# EAGLE design selwx_r1 (EAGLE 5.10)
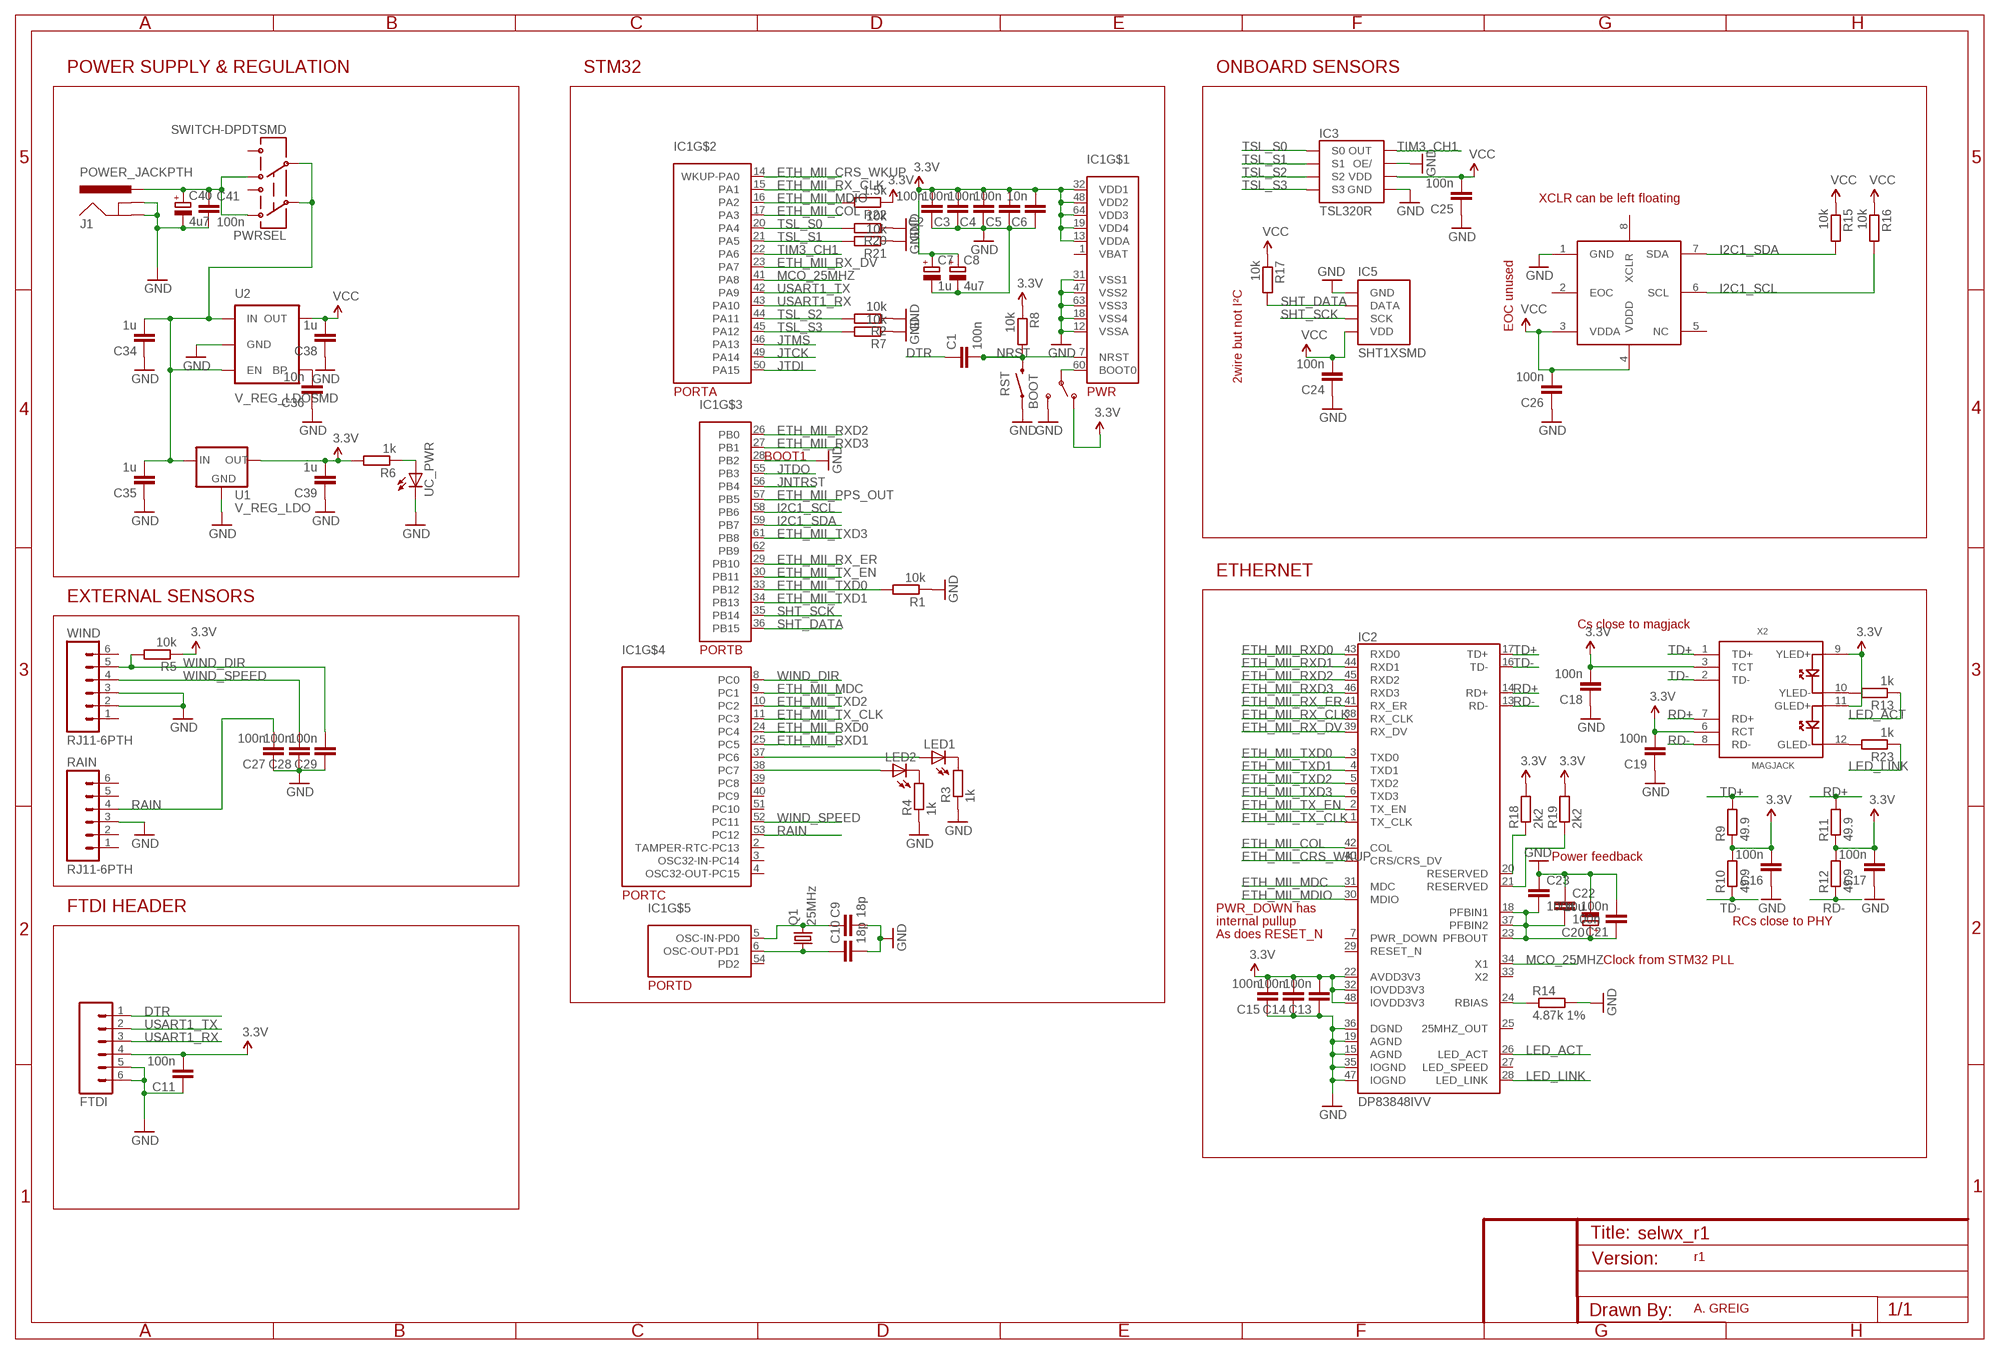
[diagram p0: schematic, sheet 1]

## Parts
BOOT  SWITCH-SPSTSMD  [AYZ0202]
C1  100n  C-EUC0603  [C0603]
C2  100n  C-EUC0603  [C0603]
C3  100n  C-EUC0603  [C0603]
C4  100n  C-EUC0603  [C0603]
C5  100n  C-EUC0603  [C0603]
C6  10n  C-EUC0603  [C0603]
C7  1u  CPOL-EUSMCA  [SMC_A]
C8  4u7  CPOL-EUSMCA  [SMC_A]
C9  18p  C-EUC0603  [C0603]
C10  18p  C-EUC0603  [C0603]
C11  100n  C-EUC0603  [C0603]
C13  100n  C-EUC0603  [C0603]
C14  100n  C-EUC0603  [C0603]
C15  100n  C-EUC0603  [C0603]
C16  100n  C-EUC0603  [C0603]
C17  100n  C-EUC0603  [C0603]
C18  100n  C-EUC0603  [C0603]
C19  100n  C-EUC0603  [C0603]
C20  10u  CPOL-EUSMCA  [SMC_A]
C21  100n  C-EUC0603  [C0603]
C22  100n  C-EUC0603  [C0603]
C23  100n  C-EUC0603  [C0603]
C24  100n  C-EUC0603  [C0603]
C25  100n  C-EUC0603  [C0603]
C26  100n  C-EUC0603  [C0603]
C27  100n  C-EUC0603  [C0603]
C28  100n  C-EUC0603  [C0603]
C29  100n  C-EUC0603  [C0603]
C34  1u  C-EUC0603  [C0603]
C35  1u  C-EUC0603  [C0603]
C36  10n  C-EUC0603  [C0603]
C38  1u  C-EUC0603  [C0603]
C39  1u  C-EUC0603  [C0603]
C40  4u7  CPOL-EUSMCA  [SMC_A]
C41  100n  C-EUC0603  [C0603]
FTDI  M06SIP_LOCK  [1X06-SIP_LOCK]
IC1  STM32F107RXTX  [LQFP64]
IC2  DP83848IVV  [LQFP48]
IC3  TSL320R  [DIL08]
IC5  SHT1XSMD  [SHT1X]
IC6  BMP085  [BMP085]
J1  POWER_JACKPTH  [POWER_JACK_PTH]
LED1  LED0603  [LED-0603]
LED2  LED0603  [LED-0603]
PWRSEL  SWITCH-DPDTSMD  [AYZ0202]
Q1  25MHz  CRYSTAL5X3  [CRYSTAL-SMD-5X3]
R1  10k  R-EU_R0603  [R0603]
R2  10k  R-EU_R0603  [R0603]
R3  1k  R-EU_R0603  [R0603]
R4  1k  R-EU_R0603  [R0603]
R5  10k  R-EU_R0603  [R0603]
R6  1k  R-EU_R0603  [R0603]
R7  10k  R-EU_R0603  [R0603]
R8  10k  R-EU_R0603  [R0603]
R9  49.9  R-EU_R0603  [R0603]
R10  49.9  R-EU_R0603  [R0603]
R11  49.9  R-EU_R0603  [R0603]
R12  49.9  R-EU_R0603  [R0603]
R13  1k  R-EU_R0603  [R0603]
R14  4.87k 1%  R-EU_R0603  [R0603]
R15  10k  R-EU_R0603  [R0603]
R16  10k  R-EU_R0603  [R0603]
R17  10k  R-EU_R0603  [R0603]
R18  2k2  R-EU_R0603  [R0603]
R19  2k2  R-EU_R0603  [R0603]
R20  10k  R-EU_R0603  [R0603]
R21  10k  R-EU_R0603  [R0603]
R22  1.5k  R-EU_R0603  [R0603]
R23  1k  R-EU_R0603  [R0603]
RAIN  RJ11-6PTH  [RJ11-6]
RST  SWITCH-MOMENTARY-2SMD  [TACTILE_SWITCH_SMD]
U1  V_REG_LDO  V_REG_MIC2920  [SOT223]
U2  V_REG_LDOSMD  [SOT23-5]
UC_PWR  LED3MM  [LED3MM]
WIND  RJ11-6PTH  [RJ11-6]
X2  MAGJACK  [MAGJACK]

## Nets
3.3V: BOOT.1(O) C2.2 C3.2 C4.2 C5.2 C6.2 C7.+ C8.+ C11.2 C13.2 C14.2 C15.2 C16.2 C17.2 C18.2 C19.2 C39.2 FTDI.4 IC1.13(VDDA) IC1.19(VDD4) IC1.32(VDD1) IC1.48(VDD2) IC1.64(VDD3) IC2.22(AVDD3V3) IC2.32(IOVDD3V3) IC2.48(IOVDD3V3) R5.1 R6.2 R8.1 R9.1 R10.2 R11.1 R12.2 R18.2 R19.2 R22.1 U1.3(OUT) X2.3(TCT) X2.6(RCT) X2.9(YLED+) X2.11(GLED+)
BOOT0: BOOT.2(P) IC1.60(BOOT0)
DTR: C1.1 FTDI.1
ETH_MII_COL: IC1.17(PA3) IC2.42(COL)
ETH_MII_CRS_WKUP: IC1.14(WKUP-PA0) IC2.40(CRS/CRS_DV)
ETH_MII_MDC: IC1.9(PC1) IC2.31(MDC)
ETH_MII_MDIO: IC1.16(PA2) IC2.30(MDIO) R22.2
ETH_MII_PPS_OUT: IC1.57(PB5)
ETH_MII_RX_CLK: IC1.15(PA1) IC2.38(RX_CLK)
ETH_MII_RX_DV: IC1.23(PA7) IC2.39(RX_DV)
ETH_MII_RX_ER: IC1.29(PB10) IC2.41(RX_ER)
ETH_MII_RXD0: IC1.24(PC4) IC2.43(RXD0)
ETH_MII_RXD1: IC1.25(PC5) IC2.44(RXD1)
ETH_MII_RXD2: IC1.26(PB0) IC2.45(RXD2)
ETH_MII_RXD3: IC1.27(PB1) IC2.46(RXD3)
ETH_MII_TX_CLK: IC1.11(PC3) IC2.1(TX_CLK)
ETH_MII_TX_EN: IC1.30(PB11) IC2.2(TX_EN)
ETH_MII_TXD0: IC1.33(PB12) IC2.3(TXD0) R1.2
ETH_MII_TXD1: IC1.34(PB13) IC2.4(TXD1)
ETH_MII_TXD2: IC1.10(PC2) IC2.5(TXD2)
ETH_MII_TXD3: IC1.61(PB8) IC2.6(TXD3)
GND: BOOT.3(S) C2.1 C3.1 C4.1 C5.1 C6.1 C7.- C8.- C9.2 C10.2 C11.1 C13.1 C14.1 C15.1 C16.1 C17.1 C18.1 C19.1 C20.- C21.2 C22.1 C23.1 C24.1 C25.1 C26.1 C27.1 C28.1 C29.1 C34.1 C35.1 C36.1 C38.1 C39.1 C40.- C41.2 FTDI.5 FTDI.6 IC1.12(VSSA) IC1.18(VSS4) IC1.28(PB2) IC1.31(VSS1) IC1.47(VSS2) IC1.63(VSS3) IC2.15(AGND) IC2.19(AGND) IC2.35(IOGND) IC2.36(DGND) IC2.47(IOGND) IC3.3(OE/) IC3.4(GND) IC5.1(GND) IC6.1(GND) J1.GND J1.GNDBREAK R1.1 R2.1 R3.1 R4.1 R7.1 R14.2 R20.1 R21.1 RAIN.3 RST.1 U1.2(GND) U2.2(GND) UC_PWR.K(C) WIND.2 WIND.3
I2C1_SCL: IC1.58(PB6) IC6.6(SCL) R16.2
I2C1_SDA: IC1.59(PB7) IC6.7(SDA) R15.2
JNTRST: IC1.56(PB4)
JTCK: IC1.49(PA14)
JTDI: IC1.50(PA15)
JTDO: IC1.55(PB3)
JTMS: IC1.46(PA13)
LED1: IC1.37(PC6) LED1.A
LED1-: LED1.C R3.2
LED2: IC1.38(PC7) LED2.A
LED2-: LED2.C R4.2
LED_ACT: IC2.26(LED_ACT) R13.1
LED_LINK: IC2.28(LED_LINK) R23.1
MCO_25MHZ: IC1.41(PA8) IC2.34(X1)
N$1: R6.1 UC_PWR.A
N$2: C40.+ C41.1 J1.PWR PWRSEL.1 PWRSEL.4
N$3: R13.2 X2.10(YLED-)
N$4: C34.2 C35.2 PWRSEL.2 PWRSEL.5 U1.1(IN) U2.1(IN) U2.3(EN)
N$5: R23.2 X2.12(GLED-)
N$8: C36.2 U2.4(BP)
N$9: C10.1 IC1.6(OSC-OUT-PD1) Q1.1
N$10: C9.1 IC1.5(OSC-IN-PD0) Q1.3
N$11: IC2.24(RBIAS) R14.1
N$13: IC2.20(RESERVED) R18.1
N$14: IC2.21(RESERVED) R19.1
NRST: C1.2 IC1.7(NRST) R8.2 RST.3
PFB: C20.+ C21.1 C22.2 C23.2 IC2.18(PFBIN1) IC2.23(PFBOUT) IC2.37(PFBIN2)
RAIN: C27.2 IC1.53(PC12) RAIN.4
RD+: IC2.14(RD+) R11.2 X2.7(RD+)
RD-: IC2.13(RD-) R12.1 X2.8(RD-)
SHT_DATA: IC1.36(PB15) IC5.2(DATA) R17.2
SHT_SCK: IC1.35(PB14) IC5.3(SCK)
TD+: IC2.17(TD+) R9.2 X2.1(TD+)
TD-: IC2.16(TD-) R10.1 X2.2(TD-)
TIM3_CH1: IC1.22(PA6) IC3.6(OUT)
TSL_S0: IC1.20(PA4) IC3.1(S0) R20.2
TSL_S1: IC1.21(PA5) IC3.2(S1) R21.2
TSL_S2: IC1.44(PA11) IC3.7(S2) R2.2
TSL_S3: IC1.45(PA12) IC3.8(S3) R7.2
USART1_RX: FTDI.3 IC1.43(PA10)
USART1_TX: FTDI.2 IC1.42(PA9)
VCC: C24.2 C25.2 C26.2 C38.2 IC3.5(VDD) IC5.4(VDD) IC6.3(VDDA) IC6.4(VDDD) R15.1 R16.1 R17.1 U2.5(OUT)
WIND_DIR: C29.2 IC1.8(PC0) R5.2 WIND.5
WIND_SPEED: C28.2 IC1.52(PC11) WIND.4
Unconnected: IC1.2(TAMPER-RTC-PC13) IC1.3(OSC32-IN-PC14) IC1.4(OSC32-OUT-PC15) IC1.39(PC8) IC1.40(PC9) IC1.51(PC10) IC1.54(PD2) IC1.62(PB9) IC2.7(PWR_DOWN) IC2.25(25MHZ_OUT) IC2.27(LED_SPEED) IC2.29(RESET_N) IC2.33(X2) IC6.2(EOC) IC6.5(NC) IC6.8(XCLR) PWRSEL.3 PWRSEL.6 RAIN.1 RAIN.2 RAIN.5 RAIN.6 WIND.1 WIND.6

## Notes on the sheet
- POWER SUPPLY & REGULATION | STM32 | ONBOARD SENSORS
- XCLR can be left floating
- EOC unused
- 2wire but not I²C
- BOOT1
- ETHERNET
- EXTERNAL SENSORS
- Cs close to magjack
- Power feedback
- FTDI HEADER | PWR_DOWN has
- internal pullup | RCs close to PHY
- As does RESET_N
- Clock from STM32 PLL
- r1
- A. GREIG

## Power pins joined to a net without a drawn wire
VBAT: IC1.1(VBAT)

## Library data of the parts
BOOT = SparkFun:SWITCH-SPST: SPST Switch Simple slide switch. Spark Fun Electronics SKU : COM-00102
C1-C6 C9-C11 C13-C19 C21-C29 C34-C36 C38 C39 C41 = rcl:C-EU: CAPACITOR, European symbol
C7 C8 C20 C40 = rcl:CPOL-EU: POLARIZED CAPACITOR, European symbol
FTDI = SparkFun:M06: Header 6 Standard 6-pin 0.1" header. Use with straight break away headers (SKU : PRT-00116), right angle break away headers (PRT-00553), swiss pins (PRT-00743), machine pins (PRT-00117), and female headers (PRT-00115). Molex polarized connector foot print use with SKU : PRT-08094 with associated crimp pins and housings. NOTES ON THE VARIANTS LOCK and LOCK_LONGPADS... This footprint was designed to help hold the alignment of a through-hole component (i.e. 6-pin header) while soldering it into place. You may notice that each hole has been shifted either up or down by 0.005 of an inch from it's more standard position (which is a perfectly straight line). This slight alteration caused the pins (the squares in the middle) to touch the edges of the holes. Because they are alternating, it causes a "brace" to hold the component in place. 0.005 has proven to be the perfect amount of "off-center" position when using our standard breakaway headers. Although looks a little odd when you look at the bare footprint, once you have a header in there, the alteration is very hard to notice. Also, if you push a header all the way into place, it is covered up entirely on the bottom side. This idea of altering the position of holes to aid alignment will be further integrated into the Sparkfun Library for other footprints. It can help hold any component with 3 or more connection pins.
IC1 = selwx_parts:STM32F107RXTX: STM32 connectivity line LQFP64 package
IC2 = selwx_parts:DP83848IVV: Ethernet 10/100 PHY
IC3 = selwx_parts:TSL320R
IC5 = SparkFun:SHT1X: SHT1x Humdity Sensor Sensirion humdity sensor. Schematic element and footprint proven. Spark Fun Electronics SKU : COM-08227
IC6 = SparkFun:BMP085
J1 = SparkFun:POWER_JACK: Power Jack This is the standard 5.5mm barrel jack for power. The PTH is the most common, proven, reliable, footprint. All others are experimental. The Slot footprint only works if the mill layer is transmitted to the PCB fab house so be warned. Spark Fun Electronics SKU : PRT-00119. Mating wall wart : TOL-00298 (and others)
LED1 LED2 UC_PWR = SparkFun:LED: LEDs Standard schematic elements and footprints for 5mm, 3mm, 1206, and 0603 sized LEDs. 5mm - Spark Fun Electronics SKU : COM-00529 (and others)
PWRSEL = SparkFun:SWITCH-DPDT: DPDT Version of the COM-00597
Q1 = SparkFun:CRYSTAL: Crystals Various standard crystals. Proven footprints. Spark Fun Electronics SKU : COM-00534
R1-R23 = rcl:R-EU_: RESISTOR, European symbol
RAIN WIND = SparkFun:RJ11-6: RJ11 Jack Simple 6 pin RJ11 jack. Commonly found on CAT3 devices and Microchip programmers. SKU: PRT-00132
RST = SparkFun:SWITCH-MOMENTARY-2
U1 = SparkFun:V_REG_MIC2920: MIC2920A (http://www.micrel.com/_PDF/mic2920.pdf) - 400mA output LDO Regulator
U2 = SparkFun:V_REG_LDO: Voltage Regulator LDO Standard 150mA LDO voltage regulator in SOT-23 layout. Micrel part MIC5205. BP (by-pass) pin is used to lower output noise with 470pF cap.
X2 = SparkFun:MAGJACK

## Board
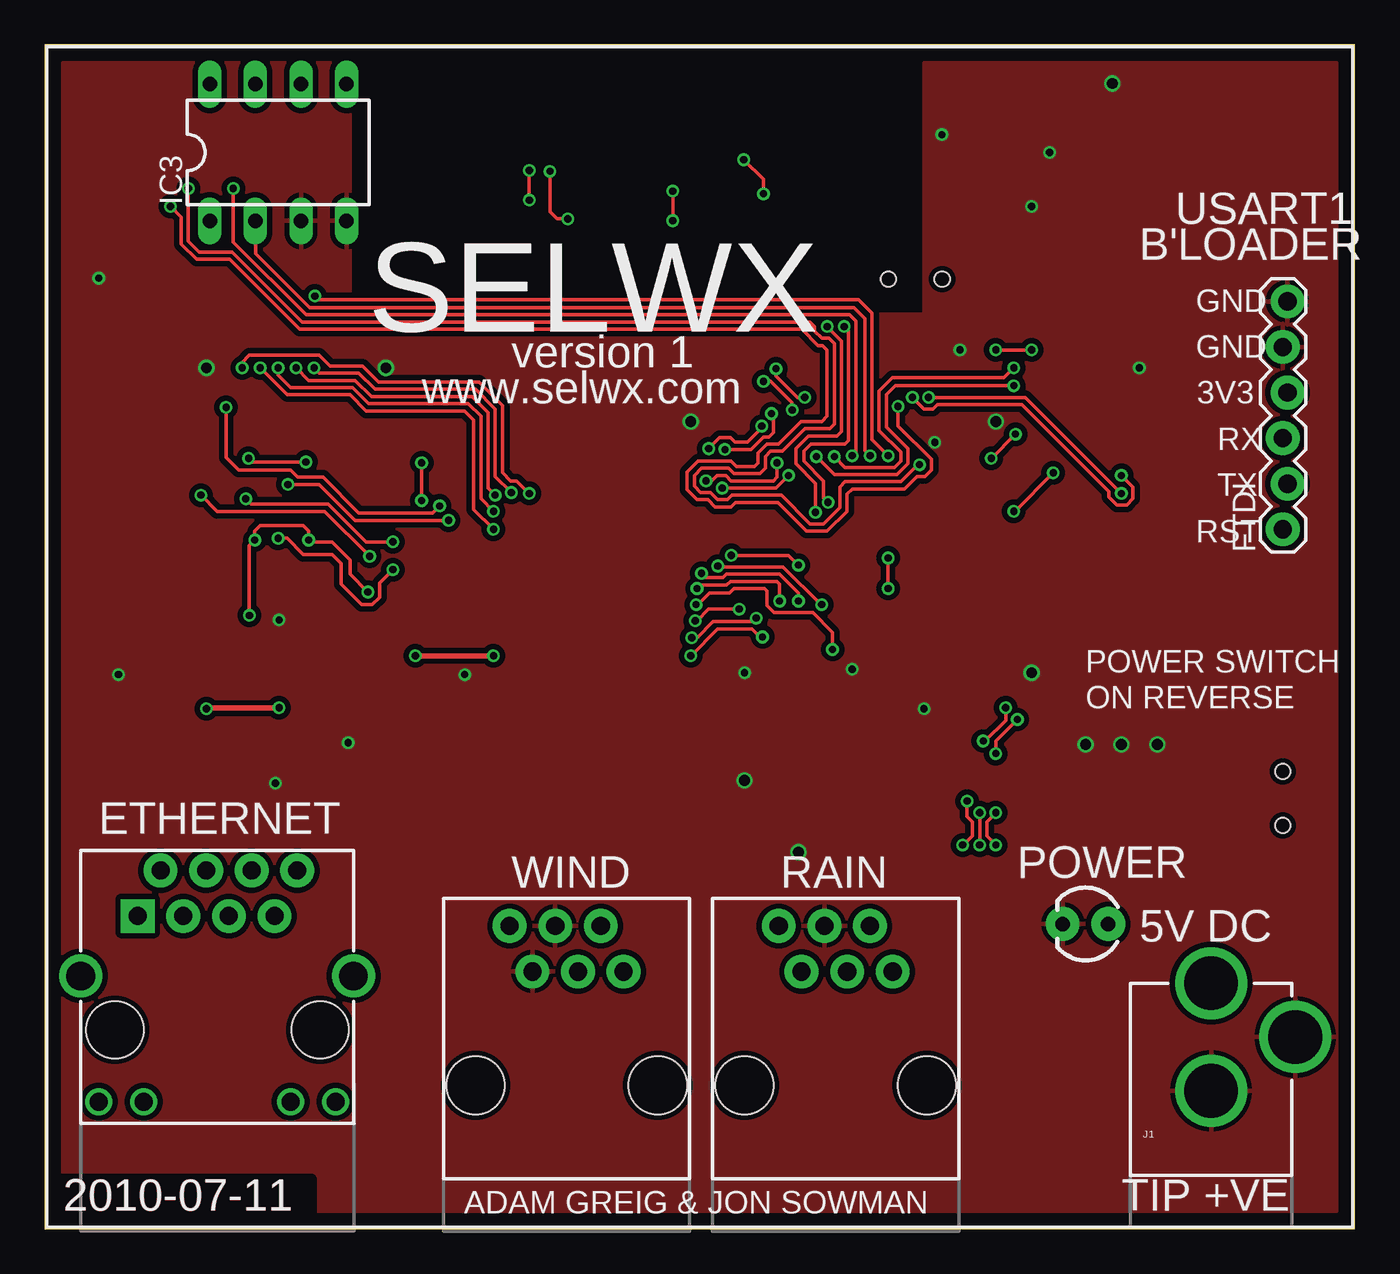
[diagram p1: board, top side]
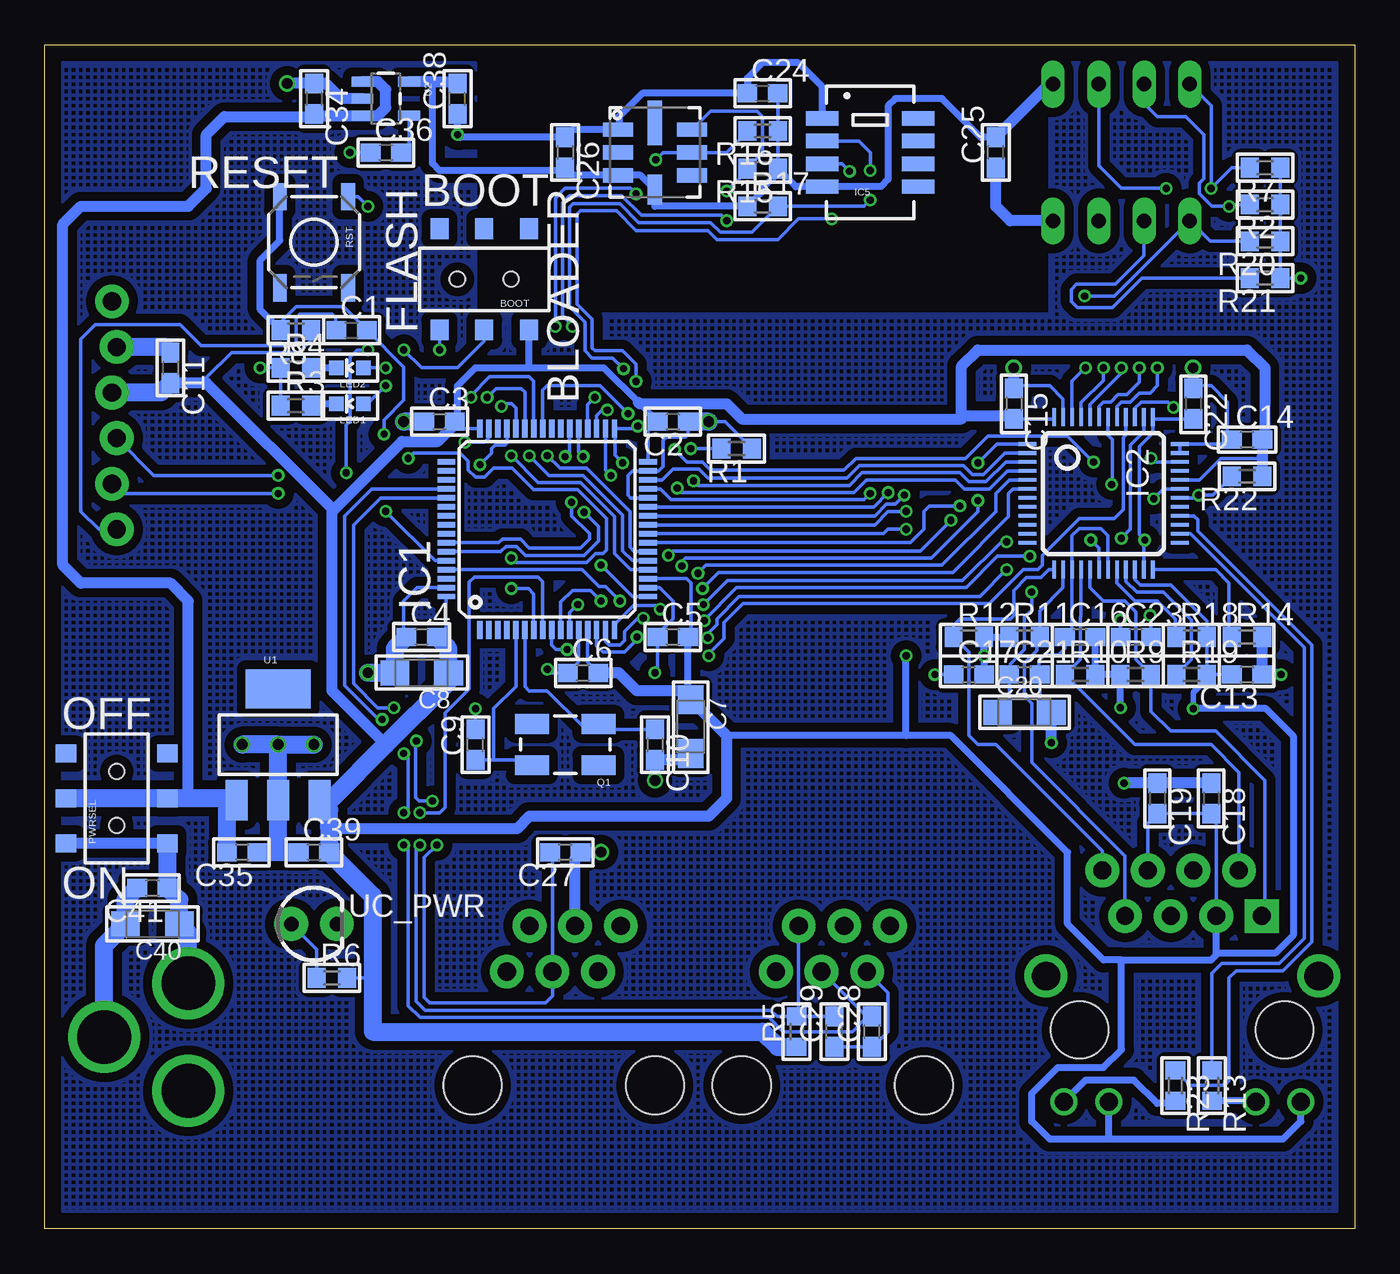
[diagram p2: board, bottom side, seen from below]

Size 73 x 66 mm. Coordinates in mm from the lower left corner, seen from the top.
Outline: 0,0 73,0 73,66 0,66 0,0
Copper layers (1*16): Top 0.035mm / dielectric 1.5mm / Bottom 0.035mm
Design rules "Fusion_eagle_rule_v1.1 *": minimum track width 6mil, minimum drill 12mil, track to track 6mil, track to pad 6mil, pad to pad 6mil, via to via 6mil, smd to smd 0mil, copper to edge 10mil, drill to drill 10mil, minimum pad ring 10mil, minimum via ring 6mil, stop-mask expansion 2mil, vias tented up to drill 100mil, thermal gap 10mil

### Footprints (pad centres in the part's own frame; a part is rotated, then mirrored left to right if it is on the bottom)
AYZ0202 = smd 1 x 1.15: 1 -2.5,2.825; 2 0,2.825; 3 2.5,2.825; 4 -2.5,-2.825; 5 0,-2.825; 6 2.5,-2.825 | hole 0.85: 1.5,0; -1.5,0
C0603 = smd 1.1 x 1: 1 -0.85,0; 2 0.85,0
SMC_A = smd 1.6 x 1.4: + -1.5,0; - 1.5,0
1X06-SIP_LOCK = drill 1.016 pad 1.88 round: 1 0,0; 2 2.54,-0.254; 3 5.08,0; 4 7.62,-0.254; 5 10.16,0; 6 12.7,-0.254
LQFP64 = smd 1 x 0.3: 1 -5.625,3.75; 2 -5.625,3.25; 3 -5.625,2.75; 4 -5.625,2.25; 5 -5.625,1.75; 6 -5.625,1.25; 7 -5.625,0.75; 8 -5.625,0.25; 9 -5.625,-0.25; 10 -5.625,-0.75; 11 -5.625,-1.25; 12 -5.625,-1.75; 13 -5.625,-2.25; 14 -5.625,-2.75; 15 -5.625,-3.25; 16 -5.625,-3.75; 33 5.625,-3.75; 34 5.625,-3.25; 35 5.625,-2.75; 36 5.625,-2.25; 37 5.625,-1.75; 38 5.625,-1.25; 39 5.625,-0.75; 40 5.625,-0.25; 41 5.625,0.25; 42 5.625,0.75; 43 5.625,1.25; 44 5.625,1.75; 45 5.625,2.25; 46 5.625,2.75; 47 5.625,3.25; 48 5.625,3.75 | smd 0.3 x 1: 17 -3.75,-5.625; 18 -3.25,-5.625; 19 -2.75,-5.625; 20 -2.25,-5.625; 21 -1.75,-5.625; 22 -1.25,-5.625; 23 -0.75,-5.625; 24 -0.25,-5.625; 25 0.25,-5.625; 26 0.75,-5.625; 27 1.25,-5.625; 28 1.75,-5.625; 29 2.25,-5.625; 30 2.75,-5.625; 31 3.25,-5.625; 32 3.75,-5.625; 49 3.75,5.625; 50 3.25,5.625; 51 2.75,5.625; 52 2.25,5.625; 53 1.75,5.625; 54 1.25,5.625; 55 0.75,5.625; 56 0.25,5.625; 57 -0.25,5.625; 58 -0.75,5.625; 59 -1.25,5.625; 60 -1.75,5.625; 61 -2.25,5.625; 62 -2.75,5.625; 63 -3.25,5.625; 64 -3.75,5.625
LQFP48 = smd 0.2 x 1: 1 -2.75,-4.25; 2 -2.25,-4.25; 3 -1.75,-4.25; 4 -1.25,-4.25; 5 -0.75,-4.25; 6 -0.25,-4.25; 7 0.25,-4.25; 8 0.75,-4.25; 9 1.25,-4.25; 10 1.75,-4.25; 11 2.25,-4.25; 12 2.75,-4.25; 25 2.75,4.25; 26 2.25,4.25; 27 1.75,4.25; 28 1.25,4.25; 29 0.75,4.25; 30 0.25,4.25; 31 -0.25,4.25; 32 -0.75,4.25; 33 -1.25,4.25; 34 -1.75,4.25; 35 -2.25,4.25; 36 -2.75,4.25 | smd 1 x 0.2: 13 4.25,-2.75; 14 4.25,-2.25; 15 4.25,-1.75; 16 4.25,-1.25; 17 4.25,-0.75; 18 4.25,-0.25; 19 4.25,0.25; 20 4.25,0.75; 21 4.25,1.25; 22 4.25,1.75; 23 4.25,2.25; 24 4.25,2.75; 37 -4.25,2.75; 38 -4.25,2.25; 39 -4.25,1.75; 40 -4.25,1.25; 41 -4.25,0.75; 42 -4.25,0.25; 43 -4.25,-0.25; 44 -4.25,-0.75; 45 -4.25,-1.25; 46 -4.25,-1.75; 47 -4.25,-2.25; 48 -4.25,-2.75
DIL08 = drill 0.813 long: 1 -3.81,-3.81; 2 -1.27,-3.81; 3 1.27,-3.81; 4 3.81,-3.81; 5 3.81,3.81; 6 1.27,3.81; 7 -1.27,3.81; 8 -3.81,3.81
SHT1X = smd 1.8 x 0.8: 1 -2.667,1.905; 2 -2.667,0.635; 3 -2.667,-0.635; 4 -2.667,-1.905; 5 2.667,-1.905; 6 2.667,-0.635; 7 2.667,0.635; 8 2.667,1.905
BMP085 = smd 1.67 x 0.8: 1 -2.065,1.27; 2 -2.065,0; 3 -2.065,-1.27; 5 2.065,-1.27; 6 2.065,0; 7 2.065,1.27 | smd 0.8 x 1.67: 4 0,-2.065 | smd 0.8 x 2.5: 8 0,1.65
POWER_JACK_PTH = drill 2.997 round: GND 0,7.7; GNDBREAK 4.7,10.7; PWR 0,13.7
LED-0603 = smd 0.8 x 0.8: A 0,-0.75; C 0,0.75
CRYSTAL-SMD-5X3 = smd 1.9 x 1.1: 1 -1.85,-1.15; 2 1.85,-1.15; 3 1.85,1.15; 4 -1.85,1.15
R0603 = smd 1 x 1.1: 1 -0.85,0; 2 0.85,0
RJ11-6 = drill 1.016 pad 1.88 round: 1 1.905,8.89; 2 3.175,6.35; 3 4.445,8.89; 4 5.715,6.35; 5 6.985,8.89; 6 8.255,6.35 | hole 3.251: 0,0; 10.16,0
TACTILE_SWITCH_SMD = smd 1.524 x 0.762: 1 -2.54,1.905; 2 2.54,1.905; 3 -2.54,-1.905; 4 2.54,-1.905
SOT223 = smd 1.219 x 2.235: 1 -2.311,-3.099; 2 0,-3.099; 3 2.311,-3.099 | smd 3.6 x 2.2: 4 0,3.099
SOT23-5 = smd 0.55 x 1.2: 1 -0.95,-1.3; 2 0,-1.3; 3 0.95,-1.3; 4 0.95,1.3; 5 -0.95,1.3
LED3MM = drill 0.813 pad 1.88 round: A -1.27,0; K 1.27,0
MAGJACK = drill 1 pad 1.88 square: 1 3.175,17.445 | drill 1 pad 1.88 round: 2 4.445,19.985; 3 5.715,17.445; 4 6.985,19.985; 5 8.255,17.445; 6 9.525,19.985; 7 10.795,17.445; 8 12.065,19.985 | drill 1 pad 1.27 round: 9 1,7.1; 10 3.5,7.1; 11 11.7,7.1; 12 14.2,7.1 | drill 1.6 pad 2.184 round: M1 0,14.1; M2 15.2,14.1 | hole 3.2: 1.905,11.095; 13.335,11.095

### Placement (x,y rotation side)
BOOT  48.51,52.93 180 bottom
C1  55.9,50.1 0 bottom
C2  38,45 180 bottom
C3  51,45 0 bottom
C4  52,33 0 bottom
C5  38,33 0 bottom
C6  43,31 0 bottom
C7  37,28 270 bottom
C8  52,31 180 bottom
C9  49,27 90 bottom
C10  39,27 270 bottom
C11  66,48 270 bottom
C13  6,30.9 180 bottom
C14  6,44 0 bottom
C15  19,46 270 bottom
C16  15.3,33 0 bottom
C17  21.5,30.9 0 bottom
C18  8,24 270 bottom
C19  11,24 270 bottom
C20  18.4,28.8 0 bottom
C21  18.4,30.9 0 bottom
C22  9,46 270 bottom
C23  12.2,33 0 bottom
C24  33,63.3 0 bottom
C25  20,60 90 bottom
C26  44,60 270 bottom
C27  44,21 180 bottom
C28  26.9,11 90 bottom
C29  29,11 90 bottom
C34  58,63 270 bottom
C35  62,21 180 bottom
C36  54,60 0 bottom
C38  50,63 90 bottom
C39  58,21 0 bottom
C40  67,17 180 bottom
C41  67,19 180 bottom
FTDI  69,39 90 top
IC1  45,39 90 bottom
IC2  14,41 270 bottom
IC3  13,60 0 top
IC5  27,60 0 bottom
IC6  39,60 0 bottom
J1  65,0 0 top
LED1  56,46 90 bottom
LED2  56,48 90 bottom
PWRSEL  69,24 90 bottom
Q1  44,27 180 bottom
R1  34.45,43.5 180 bottom
R2  5,57.1 180 bottom
R3  59,45.9 0 bottom
R4  59,48 0 bottom
R5  31.1,11 90 bottom
R6  57,14 0 bottom
R7  5,59.15 180 bottom
R8  59,50.1 180 bottom
R9  12.2,30.9 0 bottom
R10  15.3,30.9 0 bottom
R11  18.4,33 0 bottom
R12  21.5,33 0 bottom
R13  7.95,8 270 bottom
R14  6,33 0 bottom
R15  33,59.1 180 bottom
R16  33,61.2 180 bottom
R17  33,57 0 bottom
R18  9.1,33 0 bottom
R19  9.1,30.9 0 bottom
R20  5,55.05 180 bottom
R21  5,53 180 bottom
R22  6,41.95 180 bottom
R23  10,8 270 bottom
RAIN  39,8 0 top
RST  58,55 270 bottom
U1  60,27 0 bottom
U2  54,63 270 bottom
UC_PWR  58,17 0 bottom
WIND  24,8 0 top
X2  2,0 0 top

### Tracks (layer width: path | path; a pad name or v marks a point on that pad's centre or on a via)
3.3V  (via drill 0.4)
  Top 0.3: v13.05,29.05 9.05,29.05 v9,29 | v25,31.95 v20.65,31.95
  Bottom 0.2: IC1.64 50.62,32.12 50.5,32 | IC1.13 42.75,31.6 C6.2 | IC1.19 37.25,36.25 37,36 37,33.15 C5.2 | IC1.48 49.77,44.62 C3.2 50,45.15 | C15.2 16.85,45.15 IC2.48 | IC1.32 39.38,44.48 C2.2 | 46.01,49.99 BOOT.1 | X2.3 7.71,22.86 C18.2 C19.2 11.53,22.62 X2.6 | C13.2 8,30.9 R19.2 R18.2 8.25,33.9 10.25,35.9 11.95,35.9 12.25,36.2 IC2.22 | R8.1 58.15,49.55 58.85,48.85 62.6,48.85 64,47.45 64,47.15 | 54.73,14 R6.2 | 36,46 36.15,46.15 | IC2.32 8.65,41.75 7.45,42.95 5.25,42.95 5.15,43.05
  Bottom 0.3: v9,29 9,29.9 8,30.9
  Bottom 0.4: C5.2 37.15,30 37.15,29.65 C7.+ | 50,45.15 50,47 49,48 46,48 | 57,40 57,40.15 | 46,48 41.85,48 39.92,46.08 C2.2 | 25,27.5 35,27.5 | R12.2 C17.2 | R12.2 R11.1 | C16.2 R10.2 R9.1 v13.05,29.05 | 7.71,15.29 7.6,15.4 4.4,15.4 3.4,16.4 3.4,27.45 4.95,29 v9,29 | 13,15 8,15 7.71,15.29 | 7.71,15.29 X2.3 | v20.65,31.95 R12.2 | 46.01,49.99 46.01,48.01 46,48 | 21.7,45.35 21.8,45.35 22,45.15 | X2.9 3,6 4,5 13.8,5 | 13.8,5 17,5 18,6 18,7.55 16.55,9 14,9 13,10 13,15 | X2.11 13.7,5.1 13.8,5 | 25,27.5 22.5,27.5 16,21 16,17 14,15 13,15 | 25,27.5 v25,31.95
  Bottom 0.6: 54,27 57,30 57,40 53.1,43.9 51.1,43.9 50.15,44.85 C3.2 | C11.2 64,47.15 57,40.15 | 57.15,22.31 46.69,22.31 46,23 36,23 35,24 35,27.5 C7.+ | C6.2 41,31 40,30 37.15,30 | 21.7,45.35 19.2,45.35 C15.2 | 39.92,46.08 39.85,46 36,46 35,46 34.15,45.15 22,45.15 21.91,45.15 21.91,48.09 21,49 6,49 5,48 5,44.15 C14.2 5.15,43.05 R22.1
  Bottom 1: C4.2 50.5,32.35 50.5,32 C8.+ 50.5,30.5 54,27 57,24 57.59,24 U1.3 57.15,23.36 57.15,22.31 C39.2 54.73,18.58 54.73,14 54.73,11 33,11 32.15,10.15 R5.1 | FTDI.4 66.53,46.62 C11.2
BOOT0  (via drill 0.4)
  Top 0.2: v54,40 54.05,40 v56.2,42.15 | v55,49 v53,49
  Bottom 0.2: IC1.60 51.25,37.25 v54,40 | v56.2,42.15 56.2,44.8 56,45 56,48.6 55.6,49 v55,49 | v53,49 52,48 50,48 48.51,49.49 BOOT.2
DTR
  Bottom 0.2: 57,50.35 C1.1 56.8,50.15 56.8,50.8 57,51 58.8,51 59,50.8 59,49.4 59.15,49.25 64.3,49.25 65.45,50.4 70.2,50.4 71,49.6 71,40 70,39 FTDI.1
ETH_MII_COL  (via drill 0.4)
  Top 0.2: v13.55,41.5 15.3,41.5 17.3,39.5 v22.5,39.5 | v38.25,37.55 41.45,37.55 v42,37
  Bottom 0.2: IC2.42 13.75,44.25 13.5,44 13.5,41.55 v13.55,41.5 | IC1.17 40.25,35.25 v42,37 | v38.25,37.55 38,37.8 24.2,37.8 v22.5,39.5
ETH_MII_CRS_WKUP  (via drill 0.4)
  Top 0.2: v40,33 39.85,33 39.4,33.45 37.5,33.45 v36,31.95
  Bottom 0.2: IC1.14 42.25,32.5 41.9,32.15 40.7,32.15 40,32.85 v40,33 | v36,31.95 36,32.05 35.15,32.9 35.15,33.8 34.1,34.85 20.35,34.85 18.45,36.75 17.65,36.75 17.4,37 17.4,37.55 15.35,39.6 13.4,39.6 12.9,40.1 12.9,44.1 12.75,44.25 IC2.40
ETH_MII_MDC  (via drill 0.4)
  Top 0.2: v11.2,40.7 11.5,40.4 15.8,40.4 17.9,38.3 v19.4,38.3 | v43.9,32.3 43.9,33.25 42.8,34.35 40.65,34.35 40.25,34.75 40.25,35.55 40.1,35.7 38.4,35.7 38.15,35.45 37.05,35.45 36.4,34.8 v36.3,34.8
  Bottom 0.2: IC2.31 10.65,41.25 v11.2,40.7 | v19.4,38.3 19.7,38.3 21.85,36.15 34.95,36.15 v36.3,34.8 | IC1.9 44.75,32.55 44.5,32.3 v43.9,32.3
ETH_MII_MDIO  (via drill 0.4)
  Top 0.2: v8.7,40.9 9.6,40 15.6,40 v18.1,37.5 | v38.7,34.55 37,34.55 36.35,33.9 v36.25,33.9
  Bottom 0.2: IC2.30 8.85,40.75 v8.7,40.9 7.9,40.9 R22.2 | v18.1,37.5 19.9,37.5 21.65,35.75 34.45,35.75 36.3,33.9 v36.25,33.9 | IC1.16 41.25,33.7 40.2,34.75 38.9,34.75 v38.7,34.55
ETH_MII_RX_CLK  (via drill 0.4)
  Top 0.2: v13,38.5 13.5,38.5 14.4,37.6 16,37.6 16.5,37.1 16.5,35.95 17.65,34.8 18.25,34.8 18.65,35.2 18.65,36 v19.4,36.75 | v39.65,34.05 39.45,33.85 37.25,33.85 36.35,32.95 v36.05,32.95
  Bottom 0.2: IC2.38 11.75,44.45 12.5,43.7 12.5,39 v13,38.5 | IC1.15 41.75,32.75 41.55,32.55 40.95,32.55 40.7,32.8 40.7,33.3 40,34 39.7,34 v39.65,34.05 | v36.05,32.95 36.05,33.2 35.55,33.7 35.55,34 34.3,35.25 20.9,35.25 v19.4,36.75
ETH_MII_RX_DV  (via drill 0.4)
  Top 0.2: v22,40.3 21.6,39.9 17.5,39.9 15.5,41.9 14.1,41.9 13.7,42.3 10.8,42.3 10.1,43 v10.1,45.8
  Bottom 0.2: v22,40.3 23.7,40.3 24,40 24,39 24.75,38.25 IC1.23 | IC2.39 12.25,45.75 11.9,46.1 10.4,46.1 v10.1,45.8
ETH_MII_RX_ER  (via drill 0.4)
  Top 0.2: v11,48 11,48.3 11.4,48.7 15.3,48.7 15.9,48.1 17.7,48.1 18.6,47.2 24.2,47.2 25.5,45.9 25.5,42.15 25.95,41.7 26.3,41.7 v27,41
  Bottom 0.2: IC2.41 13.25,45.85 13,46.1 12.5,46.1 12,46.6 11.4,46.6 11,47 v11,48 | v27,41 27.35,40.65 38.1,40.65 38.7,41.25 IC1.29
ETH_MII_RXD0  (via drill 0.4)
  Top 0.2: v12,48 13.5,46.5 17,46.5 17.9,45.6 23.4,45.6 23.9,45.1 23.9,40.1 v25,39
  Bottom 0.2: IC1.24 26.25,38.75 26,39 v25,39 | IC2.43 14.25,45.85 14,46.1 13.6,46.1 13.2,46.5 12.7,46.5 12,47.2 v12,48
ETH_MII_RXD1  (via drill 0.4)
  Top 0.2: v13,48 13,47.6 13.7,46.9 17.15,46.9 18.05,46 23.6,46 24.3,45.3 24.3,40.7 v25,40
  Bottom 0.2: IC1.25 26.75,39.25 26,40 v25,40 | IC2.44 14.75,45.95 13,47.7 v13,48
ETH_MII_RXD2  (via drill 0.4)
  Top 0.2: v14,48 14.7,47.3 17.3,47.3 18.2,46.4 23.8,46.4 24.7,45.5 24.7,41.3 v25.1,40.9
  Bottom 0.2: IC1.26 26.75,39.75 26.1,40.4 25.6,40.4 v25.1,40.9 | IC2.45 15.25,46.05 14,47.3 v14,48
ETH_MII_RXD3  (via drill 0.4)
  Top 0.2: v15,48 15.3,47.7 17.5,47.7 18.4,46.8 24,46.8 25.1,45.7 25.1,41.95 v26,41.05
  Bottom 0.2: IC1.27 26.8,40.25 v26,41.05 | IC2.46 15.75,47.25 v15,48
ETH_MII_TX_CLK  (via drill 0.4)
  Top 0.2: v43.3,34.8 43.25,34.8 41.15,36.9 37.55,36.9 v37.5,36.95 | v21,40.6 v21,42.7
  Bottom 0.2: IC1.11 43.75,34.35 v43.3,34.8 | v37.5,36.95 37.5,37.2 37.3,37.4 23.6,37.4 21,40 v21,40.6 | IC2.1 19.95,43.75 v21,42.7
ETH_MII_TX_EN
  Bottom 0.2: IC2.2 19.5,43.25 20.7,42.05 21.3,42.05 21.8,42.55 27.6,42.55 28.3,41.85 36.05,41.85 36.55,42.35 38,42.35 38.6,41.75 IC1.30
ETH_MII_TXD0  (via drill 0.4)
  Top 0.2: v36.85,41.7 37.15,41.7 37.45,42 37.95,42 38.25,41.7 40.6,41.7 40.8,41.9 v40.8,42.7 | v39.95,44.75 39.95,44.65 39.15,43.85 38.45,43.85 38.2,44.1 37.6,44.1 v37,43.5
  Bottom 0.2: 41.23,44.6 IC1.33 | IC2.3 19.45,42.75 20.55,41.65 21.5,41.65 22,42.15 27.45,42.15 28.15,41.45 36.6,41.45 v36.85,41.7 | 41.23,44.6 41.23,43.12 v40.8,42.7 | 41.23,44.6 40.1,44.6 v39.95,44.75 | v37,43.5 R1.2
ETH_MII_TXD1  (via drill 0.4)
  Top 0.2: v37.75,41.3 40.75,41.3 v41.45,42
  Bottom 0.2: IC2.4 19.35,42.25 20.35,41.25 21.75,41.25 22.25,41.75 27.2,41.75 27.9,41.05 37.5,41.05 v37.75,41.3 | IC1.34 41.75,42.3 v41.45,42
ETH_MII_TXD2  (via drill 0.4)
  Top 0.2: v42,35 42,35.45 40.95,36.5 38,36.5 37.8,36.3 36.85,36.3 v36.6,36.55
  Bottom 0.2: IC2.5 19.25,41.75 20,41 20,40 23,37 36.15,37 v36.6,36.55 | v42,35 42.6,35.6 43.6,35.6 44.25,34.95 IC1.10
ETH_MII_TXD3  (via drill 0.4)
  Top 0.2: v40.95,35 40.95,35.95 40.8,36.1 38.2,36.1 38,35.9 36.55,35.9 v36.35,35.7
  Bottom 0.2: IC2.6 19.05,41.25 19.3,41 19.3,39.7 22.4,36.6 35.45,36.6 v36.35,35.7 | IC1.61 43.05,36.75 42.1,35.8 41.75,35.8 v40.95,35
GND  (via drill 0.4, 0.6)
  Bottom 0.2: IC2.35 IC2.36 7.1,43.75 | C29.1 C28.1 26.85,10.15 26,11 26,13.18 WIND.2 | C2.1 37,44.85 | BOOT.3 v51.01,49.01 v51,49 | RST.1 55.54,57.54 v55,57 | C36.1 v56,60 | C20.- 17.55,29.45 C21.2 17.6,30.95 17.6,31.7 17.3,32 16.5,32 16.15,32.35 C16.1 15.75,33.4 IC2.15 15.75,38.65 15.35,39.05 14.15,39.05 13.75,38.65 IC2.19 | C23.1 v13.05,33.95 | C17.1 v23.4,30.9 | IC2.47 16.25,46.25 17,47 18.85,47 C15.1 | IC1.18 38.75,35.75 38,35 38,34 38.85,33.15 C5.1 38.85,31.15 v39,31 | IC1.12 43.25,31.6 C6.1 44.8,31 v45,31.2 | C9.2 v49,29 | IC1.63 52.25,35.75 53,35 53,33.15 C4.1 | R3.1 R4.1 v61,48 | 41,61.34 IC6.1 | IC1.28 40.35,40.75 40.5,40.9 40.5,42 40.25,42.25 IC1.31 38.8,42.25 38.55,42.5 38.55,43.95 38.35,44.15 37.3,44.15 37.15,44.3 C2.1 | C2.1 37.2,44.95 | IC1.47 48.25,44.1 48.5,43.85 v49.6,43.85 | R7.1 R2.1 R20.1 R21.1 v3,53 | v36,45 35.1,45 R1.1 | C14.1 7.1,43.75 | 7.1,43.75 7.1,46.1 8,47 8.85,47 C22.1
  Bottom 0.4: C38.1 v50,61 49.85,60.85 C26.1 43.58,61.27 IC6.1 | IC5.1 29.67,63.67 31,65 33,65 33.85,64.15 C24.1 39.7,63.3 41,62 41,61.34
  Bottom 0.6: C22.1 v9,48 | C15.1 v19,48 | C18.1 C19.1 v12.85,24.85 | C7.- 37.35,26.15 C10.2 v39,25 | RAIN.3 43.45,20.7 C27.1 v42,21 | U2.2 56.5,63 57.35,63.85 C34.1 v59.5,63.85 | C25.1 20,57 19.19,56.19 IC3.4 | R14.2 C13.1 v4.1,30.9 | v16.9,27.1 C20.-
  Bottom 1: C39.1 60,21 | 60,21 C35.1 | 60,21 U1.2 v60,27 | v60,27 v58,27 | v60,27 v62,27 | J1.GNDBREAK 69.7,15.8 C40.- 68.5,18.35 C41.2 | C4.1 53.5,32.35 C8.- v55,31 | FTDI.5 66.31,49.16 C11.1 | v36,45 C2.1 | C3.1 v53,45
  pour Top (isolate 0.3): 1,1 72,1 72,65 49,65 49,51 17,51 17,65 1,65
I2C1_SCL  (via drill 0.4)
  Top 0.2: v43.65,40.5 43.4,40.75 43.4,41.7 42.3,42.8 42.3,43.35 42.7,43.75 44.6,43.75 44.8,43.95 44.8,50.05 v44.55,50.3 | v40.05,57.7 40.05,58.5 v38.95,59.6
  Bottom 0.2: R16.2 33.85,61.15 35,60 IC6.6 38.55,60 v38.95,59.6 | IC1.58 47.7,38.25 47.5,38.45 46.5,38.45 46,37.95 43.15,37.95 42.65,38.45 42.65,38.75 43.65,39.75 v43.65,40.5 | v44.55,50.3 44.55,57.45 44,58 40.35,58 v40.05,57.7
I2C1_SDA  (via drill 0.4)
  Top 0.2: v42.95,39.95 42.95,41.55 41.85,42.65 41.85,43.5 42.55,44.2 44.15,44.2 44.4,44.45 44.4,49.5 v43.6,50.3 | v35,56.2 v35,57.85
  Bottom 0.2: IC6.7 35.91,62.3 33.3,62.3 33,62 33,60 33.85,59.15 R15.2 33.85,59 v35,57.85 | IC1.59 47.6,37.75 47.3,38.05 46.7,38.05 46.2,37.55 42.95,37.55 42.15,38.35 42.15,39.15 v42.95,39.95 | v43.6,50.3 43.6,50.35 44.15,50.9 44.15,57.2 43.75,57.6 40.85,57.6 39.75,56.5 35.3,56.5 v35,56.2
LED1  (via drill 0.4)
  Top 0.2: v43,43.05 44,42.05 47.5,42.05 48.1,42.65 48.1,43.5 46.9,44.7 46.9,46.5 47.4,47 v54,47
  Bottom 0.2: LED1.A 55,46 v54,47 | IC1.37 43.25,43.3 v43,43.05
LED1-
  Bottom 0.4: LED1.C 58.05,46 R3.2
LED2  (via drill 0.4)
  Top 0.2: v44,43.05 44.6,42.45 47.35,42.45 47.7,42.8 47.7,43.3 46.5,44.5 46.5,46.7 47.25,47.45 53.45,47.45 v54,48
  Bottom 0.2: v54,48 LED2.A | IC1.38 43.75,43.3 v44,43.05
LED2-
  Bottom 0.4: R4.2 LED2.C
LED_ACT
  Bottom 0.2: R13.1 7.95,14.25 7.4,14.8 4.2,14.8 2.8,16.2 2.8,32.4 9.15,38.75 IC2.26
LED_LINK
  Bottom 0.2: IC2.28 8.95,39.75 8.75,39.55 8.75,38.9 2.4,32.55 2.4,16 4,14.4 6.6,14.4 7,14 7,8.25 7.25,8 9.15,8 R23.1
MCO_25MHZ  (via drill 0.4)
  Top 0.2: v14.55,42.75 11.55,42.75 v11.35,42.95 | v37.9,43.45 39.35,43.45 40.05,44.15 40.35,44.15 40.6,44.4 40.6,45.35 v40.5,45.45
  Bottom 0.2: v11.35,42.95 11.15,42.75 IC2.34 | v37.9,43.45 37.2,42.75 36.35,42.75 35.9,42.3 28.45,42.3 27.8,42.95 21.7,42.95 20.45,44.2 16,44.2 v14.55,42.75 | v40.5,45.45 42.05,47 45,47 45.25,46.75 IC1.41
N$1
  Bottom 0.2: R6.1 57.85,15.58 UC_PWR.A
N$2
  Bottom 0.6: PWRSEL.4 PWRSEL.1
  Bottom 1: J1.PWR 65,16.5 C40.+ 65.5,18.35 C41.1 66.15,21.48 PWRSEL.4
N$3
  Bottom 0.4: R13.2 5.55,7.15 X2.10
N$4
  Bottom 0.6: U2.1 54.45,63.95 54,63.5 54,62.5 54.45,62.05 U2.3 57.9,62.05 C34.2 58.15,62 63,62 64,61 64,58 65,57 71,57 72,56 72,37 71,36 66,36 65,35 65,24
  Bottom 1: PWRSEL.2 PWRSEL.5 65,24 62.41,24 U1.1 62.85,23.36 C35.2
N$5
  Bottom 0.4: X2.12 15,8.3 12.3,8.3 11,7 10,7 R23.2
N$6
  pour Bottom (isolate 0.5, hatched): 1,65 17,65 17,51 49,51 49,65 72,65 72,1 1,1
N$8
  Bottom 0.2: U2.4 52.7,60.45 C36.2
N$9
  Bottom 0.2: IC1.6 46.25,30.25 46,30 45,30 43,28 42.3,28 Q1.1 41.85,27.85 C10.1
N$10
  Bottom 0.2: 48,26.15 46.15,26.15 Q1.3 | 48,26.15 C9.1 | IC1.5 46.75,30.25 48,29 48,26.15
N$11
  Bottom 0.2: IC2.24 7.75,36.75 7,36 7,33.15 R14.1
N$13
  Bottom 0.2: IC2.20 13.25,36 12.25,35 11,35 10,34 10,33.05 R18.1
N$14
  Bottom 0.2: IC2.21 12.75,36.1 12.15,35.5 10.65,35.5 9.1,33.95 9.1,31.75 R19.1
NRST  (via drill 0.4)
  Top 0.2: v52.75,42.95 v54.1,44.3 | v47,37.4 v47,35.7
  Bottom 0.2: R8.2 59.85,50.55 59,51.4 56.35,51.4 C1.2 53,48.05 53,46.2 54.1,45.1 v54.1,44.3 | v52.75,42.95 52.45,43.25 49.85,43.25 49.4,42.8 49.4,42.3 49,41.9 48.5,41.9 48,42.4 46.95,42.4 45.75,41.2 43.3,41.2 41.7,39.6 41.7,37.85 41.9,37.65 42.3,37.65 42.8,37.15 46.75,37.15 v47,37.4 | IC1.7 45.75,35.4 46.05,35.7 v47,35.7
  Bottom 0.4: RST.3 59.91,55.09 61,54 61,51.25 R8.2
PFB  (via drill 0.4)
  Top 0.2: v11.4,34.2 11.4,38.1 v11.7,38.4 11.7,38.9 12,39.2 14.4,39.2 14.7,38.9 v14.7,38.4 14.7,38.3 16,38.3 17,37.3 17,36.5 v18,35.5
  Bottom 0.2: C22.2 11.15,45.15 IC2.37 11.25,44.35 12,43.6 12,38.7 v11.7,38.4 11.75,38.35 IC2.23 | C20.+ 19.25,29.45 C21.1 19.2,30.95 19.2,31.5 18.4,32.3 18.4,34.1 18,34.5 v18,35.5 | C23.2 11.35,34.15 v11.4,34.2 | IC2.18 14.25,37.95 v14.7,38.4
RAIN  (via drill 0.4)
  Top 0.2: v52.3,27.2 52.4,27.2 53.55,28.35 v53.55,29.05 | v51.15,21.4 51.2,21.4 51.7,21.9 51.7,22.7 51.4,23 v51.4,23.85
  Bottom 0.2: v53.55,29.05 54.45,29.05 55.8,30.4 55.8,39.25 54.3,40.75 IC1.53 | C27.2 44.72,20.86 RAIN.4 44.72,12.98 45.1,12.6 51.55,12.6 51.85,12.9 51.85,20.7 v51.15,21.4 | v51.4,23.85 52.15,23.85 52.35,24.05 52.35,27.15 v52.3,27.2
RD+
  Bottom 0.2: IC2.14 16.25,35.75 17.55,34.45 R11.2 17.7,33 17.7,32.25 18.4,31.55 18.4,29.7 18,29.3 18,26 12.79,20.8 X2.7
RD-
  Bottom 0.2: X2.8 14.06,21.07 20,27 21,27 21.5,27.5 21.5,32.15 R12.1 22.35,33.65 22,34 19.2,34 19,34.2 19,35.6 18.3,36.3 17.5,36.3 17.05,36.75 IC2.13
SHT_DATA  (via drill 0.4)
  Top 0.2: v42.35,46.35 41.95,46.35 40.75,47.55 v40.75,47.95 | v27,57.35 v27,59
  Bottom 0.2: IC1.36 42.75,45.95 v42.35,46.35 | IC5.2 27.64,60.63 27,60 v27,59 | v27,57.35 27.35,57 R17.2 33.6,55.55 35.35,55.55 35.9,56.1 39.9,56.1 40.95,57.15 43.55,57.15 43.75,56.95 43.75,51.4 42.9,50.55 42.9,48.95 42.5,48.55 41.35,48.55 v40.75,47.95
SHT_SCK  (via drill 0.4)
  Top 0.2: v41.65,45.65 41.65,46.05 40.45,47.25 v40.05,47.25 | v29.15,56.3 28.55,56.3 28.15,56.7 v28.15,58.95
  Bottom 0.2: IC1.35 42.25,45.35 41.95,45.65 v41.65,45.65 | IC5.3 28.57,59.37 v28.15,58.95 | v29.15,56.3 31,56.3 32.15,55.15 35.55,55.15 36.05,55.65 40.05,55.65 41.15,56.75 43.15,56.75 43.35,56.55 43.35,51.55 42.5,50.7 42.5,49.1 42.35,48.95 40.8,48.95 40.05,48.2 v40.05,47.25
TD+
  Bottom 0.2: X2.1 5,17.62 5,25 7.75,27.75 10.25,27.75 11.35,28.85 R9.2 12.2,31.75 12.2,34.4 12.8,35 14,35 14.75,35.75 IC2.17
TD-
  Bottom 0.2: X2.2 6.45,25.45 8,27 12.25,27 R10.1 15.3,31.75 15.3,34.1 15.25,34.15 IC2.16
TIM3_CH1  (via drill 0.4)
  Top 0.2: v45,43.1 45.2,43.3 45.2,50.6 44.85,50.95 14.55,50.95 10.5,55 v10.5,58
  Bottom 0.2: v10.5,58 13,58 14.27,59.27 IC3.6 | IC1.22 40.15,37.75 40.4,38 40.4,40 42.8,42.4 44.3,42.4 v45,43.1
TSL_S0  (via drill 0.4)
  Top 0.2: v47,43.1 46.1,44 46.1,51.05 45.35,51.8 15.25,51.8 v15.05,52
  Bottom 0.2: v15.05,52 13.38,52 IC3.1 8.05,55.05 R20.2 | IC1.20 40.35,36.75 41.25,37.65 41.25,39.7 43.15,41.6 45.5,41.6 v47,43.1
TSL_S1  (via drill 0.4)
  Top 0.2: v46,43.1 45.7,43.4 45.7,50.75 45.1,51.35 14.75,51.35 11.75,54.35 11.75,56.17 IC3.2
  Bottom 0.2: IC1.21 40.25,37.25 40.8,37.8 40.8,39.8 43,42 44.9,42 v46,43.1 | R21.2 11.85,53 13.5,51.35 15.45,51.35 15.8,51.7 15.8,52.35 15.5,52.65 13.35,52.65 11.75,54.25 11.75,56.17 IC3.2
TSL_S2  (via drill 0.4)
  Top 0.2: v47.55,45.85 47.55,44.75 49.4,42.9 49.4,42.3 49.05,41.95 48.6,41.95 47.9,41.25 45,41.25 44.7,40.95 44.7,40 43.6,38.9 42.45,38.9 40.85,40.5 38.5,40.5 38.25,40.25 37.35,40.25 36.95,40.65 36.35,40.65 35.8,41.2 35.8,42.2 36.4,42.8 38.25,42.8 38.55,42.5 39.55,42.5 39.75,42.7 39.75,43.25 40.25,43.75 40.9,43.75 42.15,45 43.3,45 43.6,45.3 43.6,49 43.35,49.25 43.1,49.25 42.2,50.15 14.2,50.15 10.3,54.05 8.45,54.05 7.6,54.9 7.6,56.4 v7,57
  Bottom 0.2: IC1.44 46.75,45.75 47,46 47.4,46 v47.55,45.85 | IC3.7 11.73,62.73 11,62 9.4,62 8.4,61 8.4,58.55 8.65,58.3 8.65,57.7 7.95,57 v7,57 6.9,57.1 R2.2
TSL_S3  (via drill 0.4)
  Top 0.2: v48.75,42.6 48.65,42.6 47.7,41.65 44.6,41.65 44.3,41.35 44.3,40.2 43.4,39.3 42.65,39.3 41.05,40.9 38.3,40.9 38.05,40.65 37.5,40.65 37.1,41.05 36.55,41.05 36.2,41.4 36.2,42 36.6,42.4 38.1,42.4 38.4,42.1 39.85,42.1 40.15,42.4 40.15,43.05 40.45,43.35 41.1,43.35 42.35,44.6 43.75,44.6 44,44.85 44,49.35 43.7,49.65 43.3,49.65 42.9,50.05 42.9,50.3 42.65,50.55 14.35,50.55 10.45,54.45 8.6,54.45 8,55.05 v8,58
  Bottom 0.2: IC1.45 47.25,43.8 47.35,43.7 47.9,43.7 48.1,43.5 48.1,43.25 v48.75,42.6 | IC3.8 8,62.62 v8,58 6.85,59.15 R7.2
USART1_RX  (via drill 0.4)
  Top 0.2: v48.35,46.35 49,45.7 49.5,45.7 49.75,45.95 54.45,45.95 59.3,41.1 59.3,40.8 59.75,40.35 60.3,40.35 60.65,40.7 60.65,41.35 v60,42
  Bottom 0.2: IC1.43 46.25,46.65 46.45,46.85 47.85,46.85 v48.35,46.35 | v60,42 66.92,42 FTDI.3
USART1_TX  (via drill 0.4)
  Top 0.2: v49.25,46.35 54.65,46.35 v60,41
  Bottom 0.2: IC1.42 45.75,47.25 46,47.5 48.2,47.5 49.25,46.45 v49.25,46.35 | v60,41 68.71,41 FTDI.2
VCC
  Bottom 0.2: C24.2 R16.1 R15.1 32.15,58.85
  Bottom 0.4: R15.1 31.14,58.09 IC5.4 26.4,58.1 26,58.5 26,62.6 25.6,63 23,63 20.85,60.85 C25.2 | 32.15,58.85 33,58 33,57.85 R17.1 39,57 IC6.4 39.8,58.73 IC6.3 43.58,58.73 C26.2 44.15,59 51,59 51.4,59.4 51.4,63.95
  Bottom 0.6: U2.5 51.4,63.95 50.1,63.95 C38.2 | IC3.5 17.04,63.81 C25.2
WIND_DIR  (via drill 0.4)
  Top 0.2: v52.1,21.4 v52.1,23.2
  Bottom 0.2: C29.2 R5.2 | WIND.5 31,16.88 31,11.95 R5.2 | v52.1,21.4 52.3,21.2 52.3,12.7 51.8,12.2 32.55,12.2 32.2,11.85 R5.2 | IC1.8 45.25,36.1 45.5,36.35 49.05,36.35 49.35,36.05 49.35,30.1 50.7,28.75 50.7,23.5 51,23.2 v52.1,23.2
WIND_SPEED  (via drill 0.4)
  Top 0.2: v53,21.4 52.5,21.9 52.5,22.7 v53,23.2 | v53,26.5 53,27.2 v54.2,28.4
  Bottom 0.2: C28.2 27.21,11.85 | 27.21,11.85 WIND.4 | 27.21,11.85 27.21,11.79 28,11 31.85,11 32.65,11.8 52.1,11.8 52.75,12.45 52.75,21.15 v53,21.4 | v53,23.2 52.75,23.45 52.75,26.25 v53,26.5 | v54.2,28.4 54.4,28.4 56.3,30.3 56.3,39.75 54.8,41.25 IC1.52

### Text on the board
Top: 2010-07-11
_tplace: USART1 | B'LOADER | GND | SELWX | GND | version 1 | www.selwx.com | 3V3 | RX | TX | RST | POWER SWITCH | ON REVERSE | ETHERNET | POWER | WIND | RAIN | 5V DC | 2010-07-11 | ADAM GREIG & JON SOWMAN | TIP +VE
_bplace: BLOADER | FLASH | RESET | BOOT | OFF | ON